# EAGLE design BBB_LEA-M8T_CAPE (EAGLE 6.6.0)
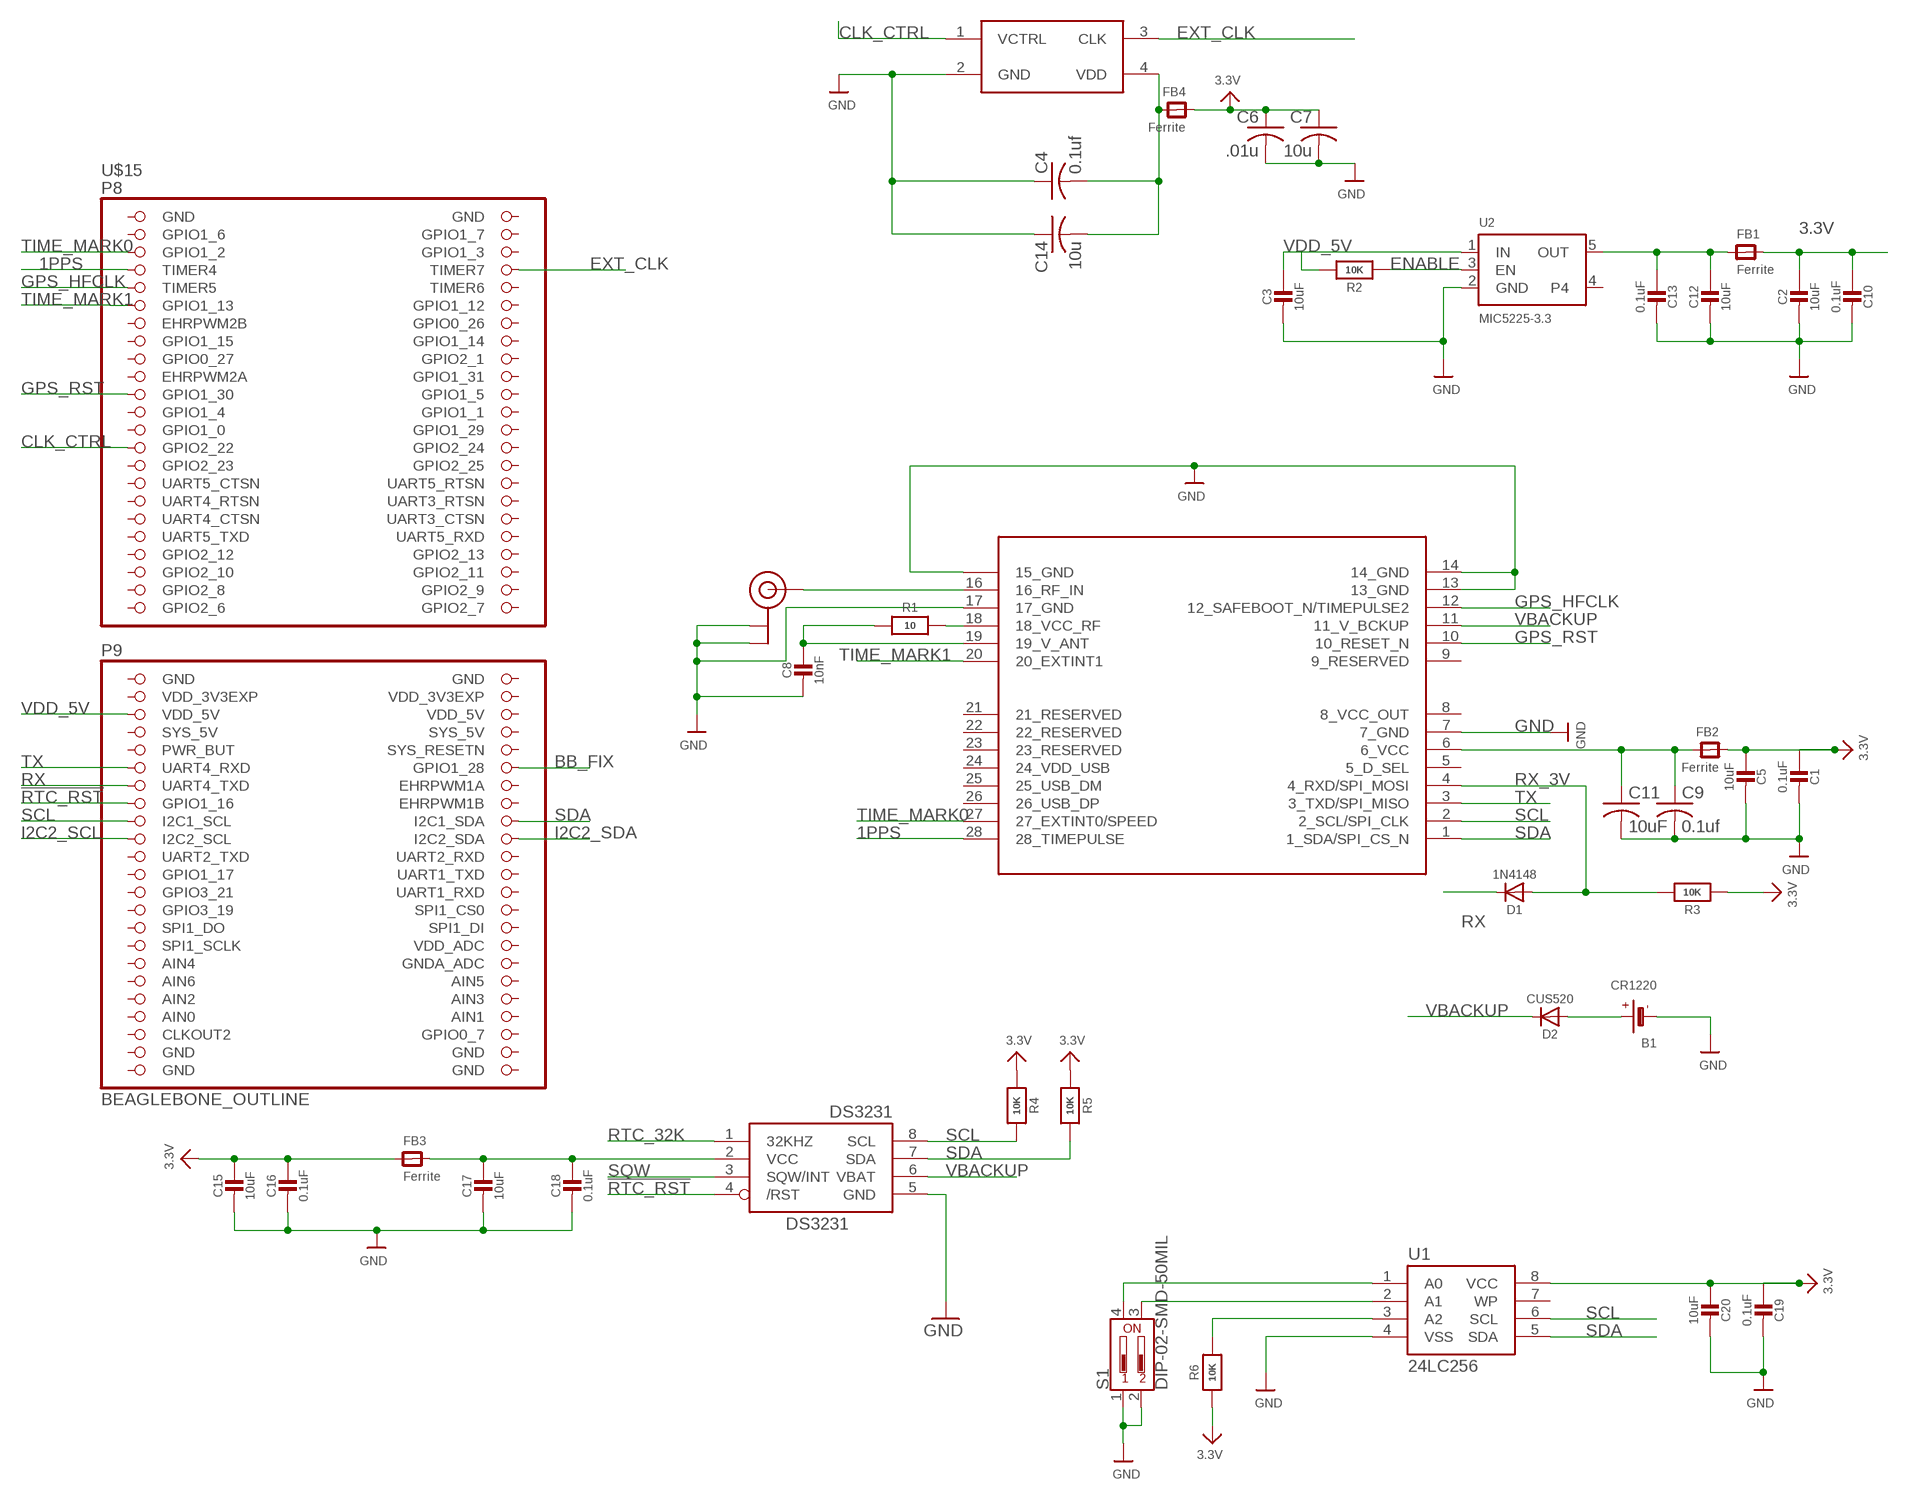
[diagram p0: schematic, sheet 1]

## Parts
B1  CR1220  BATTERYCR1220_SMT  [CR1220]
C1  0.1uF  CAP_CERAMIC0805-NOOUTLINE  [0805-NO]
C2  10uF  CAP_CERAMIC0805-NOOUTLINE  [0805-NO]
C3  10uF  CAP_CERAMIC0805-NOOUTLINE  [0805-NO]
C4  0.1uf  C-USC0805  [C0805]
C5  10uF  CAP_CERAMIC0805-NOOUTLINE  [0805-NO]
C6  .01u  C-USC0805  [C0805]
C7  10u  C-USC0805  [C0805]
C8  10nF  CAP_CERAMIC0805-NOOUTLINE  [0805-NO]
C9  0.1uf  C-USC0805  [C0805]
C10  0.1uF  CAP_CERAMIC0805-NOOUTLINE  [0805-NO]
C11  10uF  C-USC0805  [C0805]
C12  10uF  CAP_CERAMIC0805-NOOUTLINE  [0805-NO]
C13  0.1uF  CAP_CERAMIC0805-NOOUTLINE  [0805-NO]
C14  10u  C-USC0805  [C0805]
C15  10uF  CAP_CERAMIC0805-NOOUTLINE  [0805-NO]
C16  0.1uF  CAP_CERAMIC0805-NOOUTLINE  [0805-NO]
C17  10uF  CAP_CERAMIC0805-NOOUTLINE  [0805-NO]
C18  0.1uF  CAP_CERAMIC0805-NOOUTLINE  [0805-NO]
C19  0.1uF  CAP_CERAMIC0805-NOOUTLINE  [0805-NO]
C20  10uF  CAP_CERAMIC0805-NOOUTLINE  [0805-NO]
D1  1N4148  DIODESOD-323  [SOD-323]
D2  CUS520  DIODESOD-323  [SOD-323]
DS3231  DS3231M-8PIN  [SO08]
FB1  Ferrite  FERRITE-0805NO  [0805-NO@1]
FB2  Ferrite  FERRITE-0805NO  [0805-NO@1]
FB3  Ferrite  FERRITE-0805NO  [0805-NO@1]
FB4  Ferrite  FERRITE-0805NO  [0805-NO@1]
R1  10  RESISTOR0805_NOOUTLINE  [0805-NO]
R2  10K  RESISTOR0805_NOOUTLINE  [0805-NO]
R3  10K  RESISTOR0805_NOOUTLINE  [0805-NO]
R4  10K  RESISTOR0805_NOOUTLINE  [0805-NO]
R5  10K  RESISTOR0805_NOOUTLINE  [0805-NO]
R6  10K  RESISTOR0805_NOOUTLINE  [0805-NO]
S1  DIP-02-SMD-50MIL  [DIPSWITCH-02-50MIL]
U1  24LC256  EEPROM-I2CSMD  [SO08]
U2  MIC5225-3.3  VREG_SOT23-5  [SOT23-5]
U$1  LEA-M8  [LEA-M8]
U$3  TAITIEN_TW-SERIES_OSCILLATOR  [TAITIEN_TW-SERIES_OSCILLATOR]
U$15  BEAGLEBONE_OUTLINE  [BEAGLEBONE_SHIELD]
U$20  U.FL  [U.FL]

## Nets
1PPS: U$1.28(28_TIMEPULSE) U$15.7(TIMER4)
3.3V: C1.1 C2.1 C5.1 C6.1 C7.1 C10.1 C15.1 C16.1 C19.1 C20.1 FB1.2 FB2.1 FB3.1 FB4.1 R3.1 R4.1 R5.1 R6.1 U1.8(VCC)
!RTC_RST: DS3231.4(/RST) U$15.61(GPIO1_16)
BB_FIX: U$15.58(GPIO1_28)
CLK_CTRL: U$3.1(VCTRL) U$15.27(GPIO2_22)
ENABLE: R2.1 U2.3(EN)
EXT_CLK: U$3.3(CLK) U$15.8(TIMER7)
GND: B1.- C1.2 C2.2 C3.2 C4.1 C5.2 C6.2 C7.2 C8.2 C9.2 C10.2 C11.2 C12.2 C13.2 C14.1 C15.2 C16.2 C17.2 C18.2 C19.2 C20.2 DS3231.5(GND) S1.1 S1.2 U1.4(VSS) U2.2(GND) U$1.7(7_GND) U$1.13(13_GND) U$1.14(14_GND) U$1.15(15_GND) U$1.17(17_GND) U$3.2(GND) U$20.P$1(GND) U$20.P$2(GND)
GPS_HFCLK: U$1.12(12_SAFEBOOT_N/TIMEPULSE2) U$15.9(TIMER5)
GPS_RST: U$1.10(10_RESET_N) U$15.21(GPIO1_30)
I2C2_SCL: U$15.65(I2C2_SCL)
I2C2_SDA: U$15.66(I2C2_SDA)
N$1: B1.+$1(+) D2.A
N$2: C9.1 C11.1 FB2.2 U$1.6(6_VCC)
N$3: C12.1 C13.1 FB1.1 U2.5(OUT)
N$4: U$1.16(16_RF_IN) U$20.P$3(SIGNAL)
N$5: C4.2 C14.2 FB4.2 U$3.4(VDD)
N$8: C17.1 C18.1 DS3231.2(VCC) FB3.2
N$13: R6.2 U1.3(A2)
N$15: S1.3 U1.2(A1)
N$16: S1.4 U1.1(A0)
N$20: R1.2 U$1.18(18_VCC_RF)
N$21: C8.1 R1.1 U$1.19(19_V_ANT)
RTC_32K: DS3231.1(32KHZ)
RX: D1.C U$15.59(UART4_TXD)
RX_3V: D1.A R3.2 U$1.4(4_RXD/SPI_MOSI)
SCL: DS3231.8(SCL) R4.2 U1.6(SCL) U$1.2(2_SCL/SPI_CLK) U$15.63(I2C1_SCL)
SDA: DS3231.7(SDA) R5.2 U1.5(SDA) U$1.1(1_SDA/SPI_CS_N) U$15.64(I2C1_SDA)
SQW: DS3231.3(SQW/INT)
TIME_MARK0: U$1.27(27_EXTINT0/SPEED) U$15.5(GPIO1_2)
TIME_MARK1: U$1.20(20_EXTINT1) U$15.11(GPIO1_13)
TX: U$1.3(3_TXD/SPI_MISO) U$15.57(UART4_RXD)
VBACKUP: D2.C DS3231.6(VBAT) U$1.11(11_V_BCKUP)
VDD_5V: C3.1 R2.2 U2.1(IN) U$15.51(VDD_5V)
Unconnected: U1.7(WP) U2.4 U$1.5(5_D_SEL) U$1.8(8_VCC_OUT) U$1.9(9_RESERVED) U$1.21(21_RESERVED) U$1.22(22_RESERVED) U$1.23(23_RESERVED) U$1.24(24_VDD_USB) U$1.25(25_USB_DM) U$1.26(26_USB_DP) U$15.3(GPIO1_6) U$15.4(GPIO1_7) U$15.6(GPIO1_3) U$15.10(TIMER6) U$15.12(GPIO1_12) U$15.13(EHRPWM2B) U$15.14(GPIO0_26) U$15.15(GPIO1_15) U$15.16(GPIO1_14) U$15.17(GPIO0_27) U$15.18(GPIO2_1) U$15.19(EHRPWM2A) U$15.20(GPIO1_31) U$15.22(GPIO1_5) U$15.23(GPIO1_4) U$15.24(GPIO1_1) U$15.25(GPIO1_0) U$15.26(GPIO1_29) U$15.28(GPIO2_24) U$15.29(GPIO2_23) U$15.30(GPIO2_25) U$15.31(UART5_CTSN) U$15.32(UART5_RTSN) U$15.33(UART4_RTSN) U$15.34(UART3_RTSN) U$15.35(UART4_CTSN) U$15.36(UART3_CTSN) U$15.37(UART5_TXD) U$15.38(UART5_RXD) U$15.39(GPIO2_12) U$15.40(GPIO2_13) U$15.41(GPIO2_10) U$15.42(GPIO2_11) U$15.43(GPIO2_8) U$15.44(GPIO2_9) U$15.45(GPIO2_6) U$15.46(GPIO2_7) U$15.54(SYS_5V) U$15.55(PWR_BUT) U$15.56(SYS_RESETN) U$15.60(EHRPWM1A) U$15.62(EHRPWM1B) U$15.67(UART2_TXD) U$15.68(UART2_RXD) U$15.69(GPIO1_17) U$15.70(UART1_TXD) U$15.71(GPIO3_21) U$15.72(UART1_RXD) U$15.73(GPIO3_19) U$15.74(SPI1_CS0) U$15.75(SPI1_DO) U$15.76(SPI1_DI) U$15.77(SPI1_SCLK) U$15.78(VDD_ADC) U$15.79(AIN4) U$15.80(GNDA_ADC) U$15.81(AIN6) U$15.82(AIN5) U$15.83(AIN2) U$15.84(AIN3) U$15.86(AIN1) U$15.87(CLKOUT2) U$15.88(GPIO0_7)

## Power pins joined to a net without a drawn wire
AIN0: U$15.85(AIN0)
GND: U$15.1(GND) U$15.2(GND) U$15.47(GND) U$15.48(GND) U$15.89(GND) U$15.90(GND) U$15.91(GND) U$15.92(GND)
SYS_5V: U$15.53(SYS_5V)
VDD_3V3EXP: U$15.49(VDD_3V3EXP) U$15.50(VDD_3V3EXP)
VDD_5V: U$15.52(VDD_5V)

## Library data of the parts
B1 = microbuilder:BATTERY: CR1220 SMT - Digikey: 3001K-ND CD2032 BAT-HLD-001 - Digikey: BAT-HLD-001-ND
C1-C3 C5 C8 C10 C12 C13 C15-C20 = microbuilder:CAP_CERAMIC: Ceramic Capacitors For new designs, use the packages preceded by an '_' character since they are more reliable: The following footprints should be used on most boards: _0402 - Standard footprint for regular board layouts _0603 - Standard footprint for regular board layouts _0805 - Standard footprint for regular board layouts _1206 - Standard footprint for regular board layouts For extremely tight-pitch boards where space is at a premium, the following 'micro-pitch' footprints can be used (smaller pads, no silkscreen outline, etc.): _0402MP - Micro-pitch footprint for very dense/compact boards _0603MP - Micro-pitch footprint for very dense/compact boards _0805MP - Micro-pitch footprint for very dense/compact boards _1206MP - Micro-pitch footprint for very dense/compact boards
C4 C6 C7 C9 C11 C14 = rcl:C-US: CAPACITOR, American symbol
D1 D2 = microbuilder:DIODE: Diode SMA Model Volts Amps Type Vf Ir Digikey # Notes SSA34-E3 40V 3A Schottky 480mV @ 3A 200uA @ 40V SSA34-E3/61TGITR-ND CDBA120-G 20V 1A Schottky 500mV @ 1A 500uA @ 20V 641-1014-6-ND REEL MBRA210 10V 2A Schottky 350mV @ 2A 700uA @ 10V MBRA210LT3 SOD-123 Model Volts Amps Type Vf Ir Order # Notes BAT54T1G 30V 200mA Schottky 800mV @ 200mA 2uA @ 25V BAT54T1GOSTR-ND B0530W 30V 500mA Schottky 430mV @ 500mA 130uA @ 30V B0530W-FDICT-ND REEL MBR120 20V 1A Schottky 340mV @ 1A MBR120VLSFT1GOSCT-ND SOD-323 Model Volts Amps Type Vf Ir Order # Notes PMEG2005EJ 20V 500mA Schottky 355mV @ 500mA 568-4110-1-ND ZLLS410 10V 570mA Schottky 380mV @ 570mA ZLLS410CT-ND 1N4148WS 75V 150mA Silicon/Simple 1V 1N4148WSFSCT-ND REEL SOD-523 Model Volts Amps Type Vf Ir Order # Notes BAT54XV2 30V 200mA Schottky 0.8V @ 100mA BAT54XV2CT-ND TB751S 30V 30mA Schottky RB751S-40TE61CT-ND SOT23-R/W (R = Solder Paste/Reflow Ovens, W = Hand-Soldering) Model Volts Amps Type Vf Ir Order # Notes BAT54FILM 40V 300mA Schottky 497-7162-1-ND POWERDI-5 Model Volts Amps Type Vf Ir Order # Notes PDS560 60V 5A Schottky 670mV @ 5A 150uA @ 60V PDS560DICT-ND
DS3231 = tuckerLib:DS3231M-8PIN
FB1-FB4 = microbuilder:FERRITE: Ferrite Bead 0603 MMZ1608B121C - 120 Ohm @ 100MHz, 600mA, 0.15 Ohm DC Resistance - Digikey: 445-2164-1-ND BK1608HW121-T - 120 Ohm, 600mA Ferrite Chip - Digikey: 587-1876-2-ND 0805 HZ0805B272R-10 - 2.7K Ohm @ 100MHz, 200mA, 0.8 Ohm DC Resistance - Digikey: 240-2504-1-ND (see also Murata BLM21BD272SN1L) MMZ2012Y152B - 1.5K Ohm @ 100MHz, 500mA, 0.4 Ohm DC Resistance - Digikey: 445-1560-1-ND - Mainly for high frequency (80-400MHz) MMZ2012R102A - 1K Ohm @ 100MHz, 500mA, 0.3 Ohm DC Resistance - Digikey: 445-1555-2-ND - More general purpose (10-200MHz)
R1-R6 = microbuilder:RESISTOR: Resistors For new designs, use the packages preceded by an '_' character since they are more reliable: The following footprints should be used on most boards: _0402 - Standard footprint for regular board layouts _0603 - Standard footprint for regular board layouts _0805 - Standard footprint for regular board layouts _1206 - Standard footprint for regular board layouts For extremely tight-pitch boards where space is at a premium, the following 'micro-pitch' footprints can be used (smaller pads, no silkscreen outline, etc.): _0402MP - Micro-pitch footprint for very dense/compact boards _0603MP - Micro-pitch footprint for very dense/compact boards _0805MP - Micro-pitch footprint for very dense/compact boards _1206MP - Micro-pitch footprint for very dense/compact boards
S1 = SparkFun-Switches:DIP-02: 2-Position DIP Switch 2-circuit DIP (dual inline package) switch. Commonly used to physcially set a circuit's behavior. Variants PTH-100MIL - Through-hole, 0.1"-Pitch Used on SparkFun Stepoko <https://www.sparkfun.com/products/13899> (ROB-13899) SMD-50MIL-JWING - SMD (J-Wing Pads), 0.05"-Pitch Prototype Part SMD-50MIL - SMD, 0.05"-Pitch Used on SparkFun Battery Babysitter <https://www.sparkfun.com/products/13777> (PRT-13777); PROD_ID: SWCH-13215
U1 = SparkFun-IC-Memory:EEPROM-I2C: I2C EEPROMs, 24LC256 and others 24LC256 Series 256 kb I2C 2 Wire (32 k x 8 Bit) 2.5 V Serial EEPROM SMD - SOIC-8 Datasheet SparkFun Products SparkFun UDB5 - PIC UAV Development Board <https://www.sparkfun.com/products/11703> (GPS-11703); PROD_ID: IC-09714
U2 = microbuilder:VREG_SOT23-5: SOT23-5 Fixed Voltage Regulators Part Current Out V Out V In V Dropout θJA (°C/W) TJ (°C) Digikey Part No. ADP121 150mA 3.3V 3.4-5.5V 0.09V @ 150mA -- -- ADP121-AUJZ33R7CT-ND ADP121 150mA 3.0V 3.1-5.5V 0.09V @ 150mA -- -- ADP121-AUJZ30R7CT-ND ADP122 300mA 3.3V 3.4-5.5V 0.085V @ 300mA -- -- ADP122AUJZ-3.3-R7CT-ND ADP1712 300mA 3.3V 3.5-5.5V 0.17V @ 300mA -- -- ADP1712AUJZ-3.3-R7TR-ND AP7311 (Low Cost) 150mA 3.3V 3.5-6V 0.15V @ 150mA -- -- AP7311-33WG-7DICT-ND LD39015M18R 150mA 1.8V 1.9V-5.5V 0.08V @ 100mA -- -- 497-6977-1-ND LP2985A-33DBVR 150mA 3.3V 3.3-16V 0.28V @ 150mA 206 150 296-18479-1-ND MCP1824T-3302E/OT 300mA 3.3V 3.5V-6V 0.2V @ 300mA -- -- MCP1824T-3302E/OTCT-ND MIC5205-2.5YM5 TR 150mA 2.5V 2.7-16V 0.165V @ 150mA -- -- 576-1257-2-ND MIC5205-3.0YM5 TR 150mA 3.0V 3.2V-16V 0.165V @ 150mA -- -- 576-1258-2-ND MIC5205-3.3YM5 TR 150mA 3.3V 3.5V-16V 0.165V @ 150mA -- -- 576-1259-2-ND TPS780330220 150mA 3.3V+2.2V 3.6-5.5V 250mV Max -- -- 296-23332-1-ND TDA3663/N1,135 100mA 3.3V 3.5-45V 0.18V @ 50mA -- -- 568-5343-1-ND Max operating temp can be calculated using θJA, TJ (max junction temperature), and power in watts. Set the "Maximum Ambient Temperature" until it reaches TJ ("Max Junction Temperature"), which is the absolute limit for safe use of the regulator: Heat Sink Temperature Calculator <http://www.daycounter.com/Calculators/Heat-Sink-Temperature-Calculator.phtml> For example, With 12V source into a 3.3V LP2985 and a 30mA load, we are dissipating (12V-3.3V) * 0.03A = 0.261W. With a θJA of 206 °C/W, a TJ of 150°C, and 261mW we can safely use the chip without a heat sink up to 75°C (=147.1°C Junction Temperature).
U$1 = ubloxLib:LEA-M8: u-blox LEA GNSS module
U$3 = tuckerLib:TAITIEN_TW-SERIES_OSCILLATOR
U$15 = adafruit:BEAGLEBONE_OUTLINE: Should match A3 pinout - but not completely tested
U$20 = microbuilder:U.FL: U.FL Antenna Connector

## Board
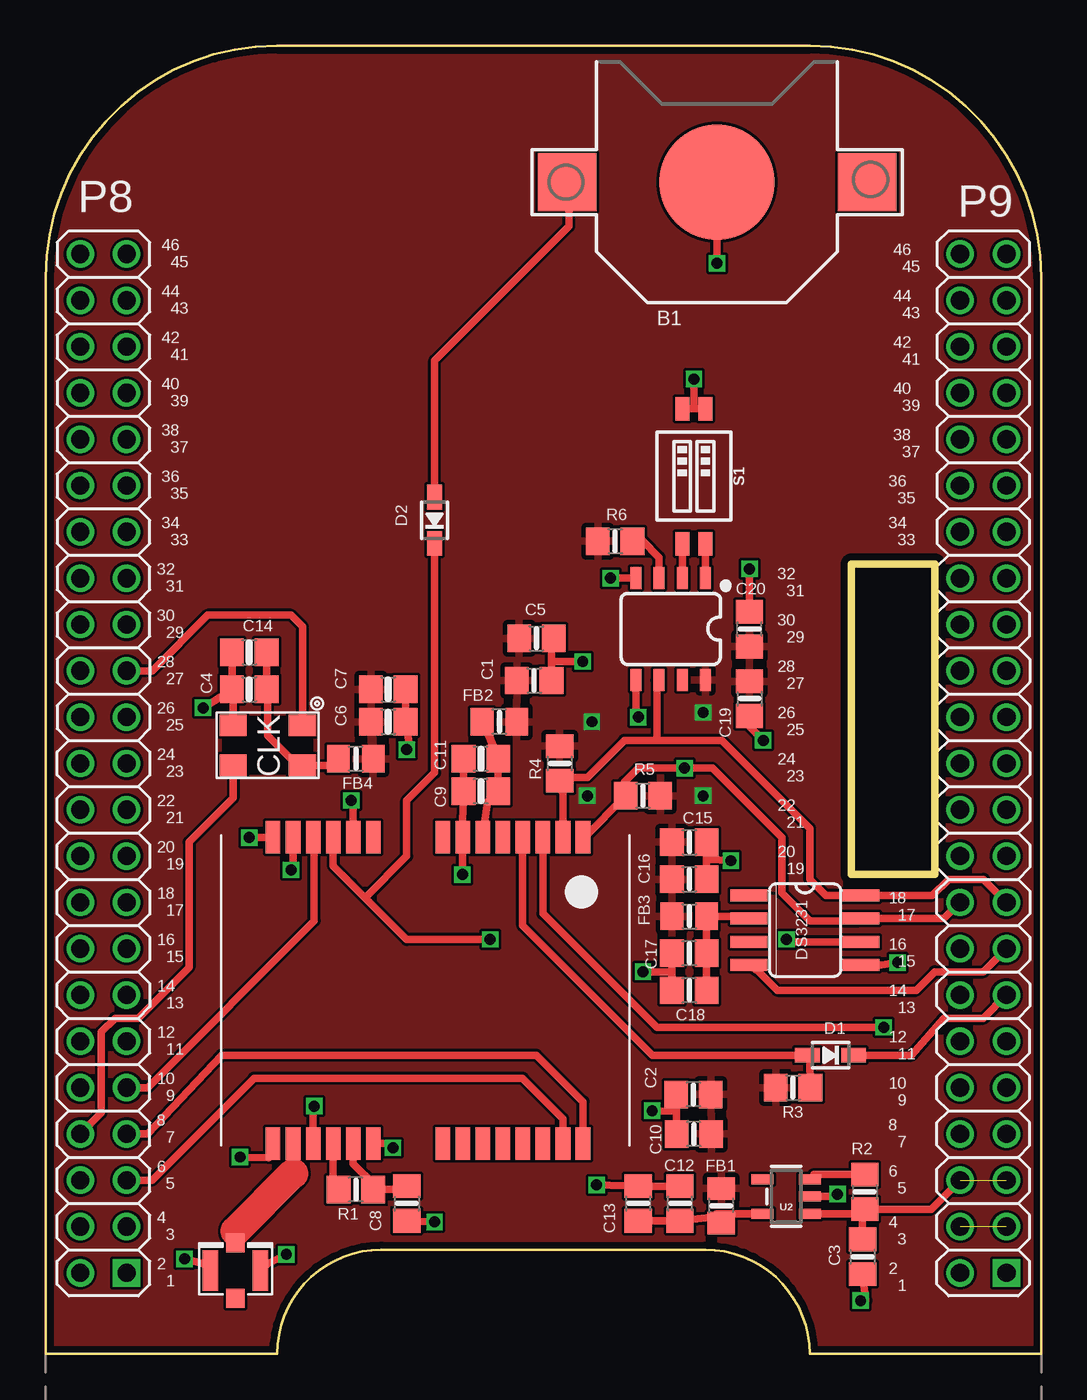
[diagram p1: board, top side]
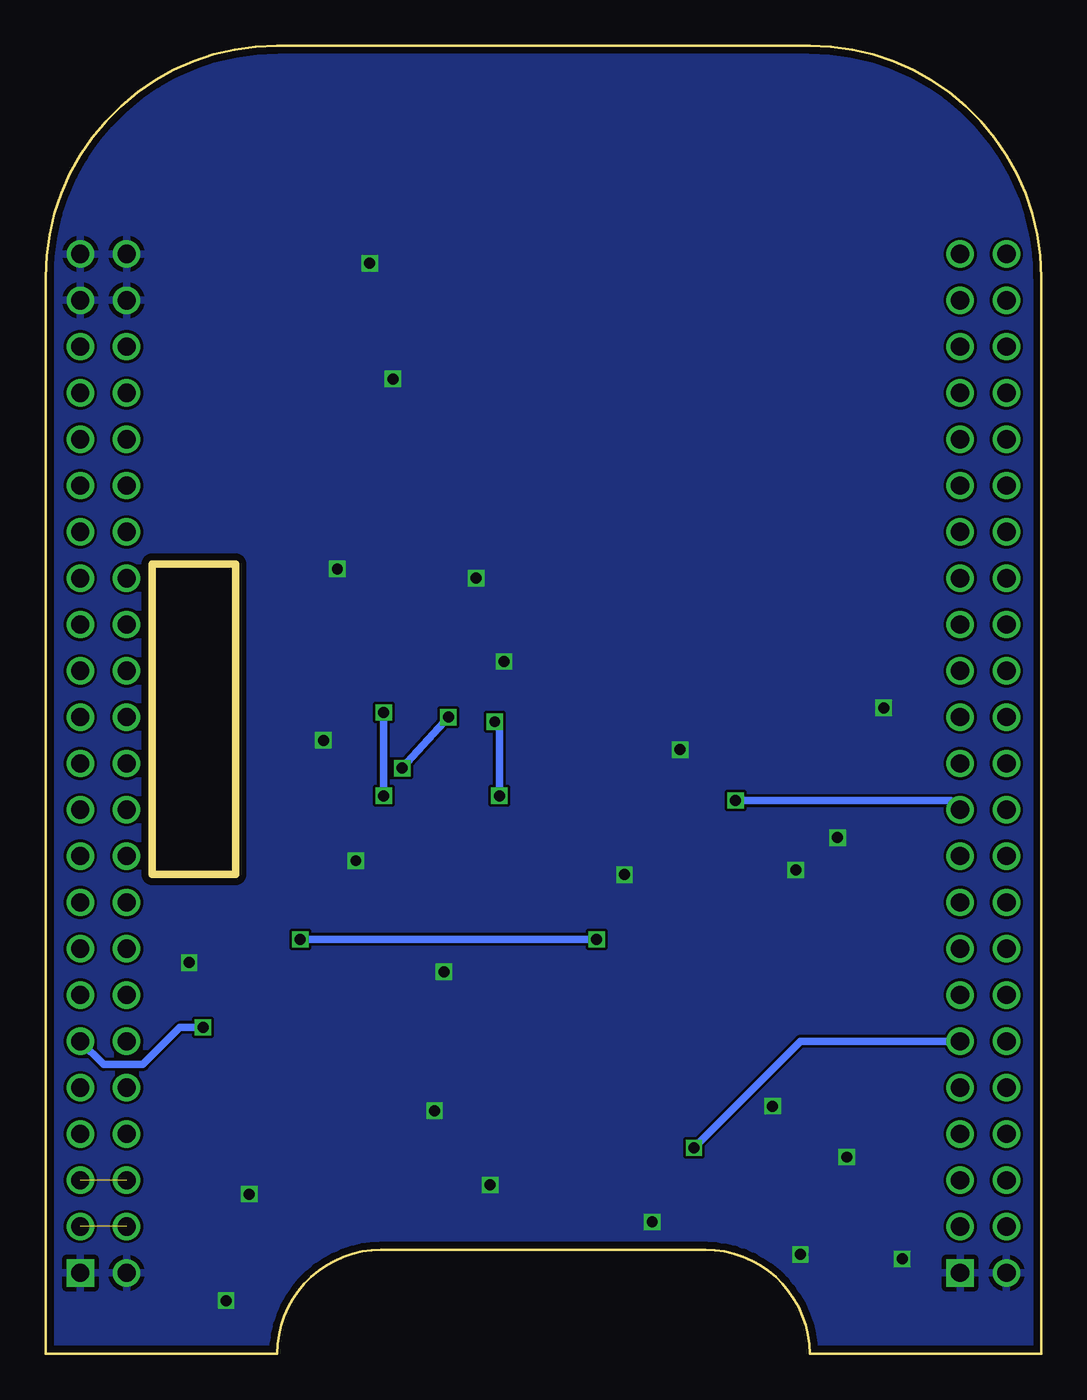
[diagram p2: board, bottom side, seen from below]

Size 54.61 x 71.76 mm. Coordinates in mm from the lower left corner, seen from the top.
Copper layers (1*16): Top 0.035559375mm / dielectric 1.6mm / Bottom 0.035559375mm
Design rules "oshpark-2layer": minimum track width 6mil, minimum drill 10mil, track to track 6mil, track to pad 6mil, pad to pad 6mil, via to via 6mil, smd to smd 6mil, copper to edge 15mil, drill to drill 6mil, minimum pad ring 5mil, minimum via ring 5mil, stop-mask expansion 2.5mil, vias tented up to drill 0mil, thermal gap 10mil
bRestrict: area 14.7,3 to 15.2,3.2; area 13.7,1.7 to 13.8,2.2; area 16.1,1.7 to 16.3,2.2

### Footprints (pad centres in the part's own frame; a part is rotated, then mirrored left to right if it is on the bottom)
CR1220 = smd 3.2 x 3.2: +$1 -8.225,0; +$2 8.225,0 | smd 6.35 x 6.35: - 0,0
0805-NO = smd 1.3 x 1.5: 1 -0.95,0; 2 0.95,0
C0805 = smd 1.3 x 1.5: 1 -0.95,0; 2 0.95,0
SOD-323 = smd 1.35 x 0.8: A 1.27,0; C -1.27,0
SO08 = smd 0.66 x 2.032: 1 -1.905,-3.073; 2 -0.635,-3.073; 3 0.635,-3.073; 4 1.905,-3.073; 5 1.905,3.073; 6 0.635,3.073; 7 -0.635,3.073; 8 -1.905,3.073
0805-NO@1 = smd 1.24 x 1.5: 1 -0.95,0; 2 0.95,0
DIPSWITCH-02-50MIL = smd 0.762 x 1.27: 1 -0.635,-3.7; 2 0.635,-3.7; 3 0.635,3.7; 4 -0.635,3.7
SO08' = smd 0.6 x 1.2: 1 -1.905,-2.8; 2 -0.635,-2.8; 3 0.635,-2.8; 4 1.905,-2.8; 5 1.905,2.8; 6 0.635,2.8; 7 -0.635,2.8; 8 -1.905,2.8
SOT23-5 = smd 0.55 x 1.2: 1 -0.95,-1.3; 2 0,-1.3; 3 0.95,-1.3; 4 0.95,1.3; 5 -0.95,1.3
LEA-M8 = smd 1.8 x 0.8: 1 8.4,-8.65; 2 8.4,-7.55; 3 8.4,-6.45; 4 8.4,-5.35; 5 8.4,-4.25; 6 8.4,-3.15; 7 8.4,-2.05; 8 8.4,-0.95; 9 8.4,2.85; 10 8.4,3.95; 11 8.4,5.05; 12 8.4,6.15; 13 8.4,7.25; 14 8.4,8.35; 15 -8.4,8.35; 16 -8.4,7.25; 17 -8.4,6.15; 18 -8.4,5.05; 19 -8.4,3.95; 20 -8.4,2.85; 21 -8.4,-0.95; 22 -8.4,-2.05; 23 -8.4,-3.15; 24 -8.4,-4.25; 25 -8.4,-5.35; 26 -8.4,-6.45; 27 -8.4,-7.55; 28 -8.4,-8.65
TAITIEN_TW-SERIES_OSCILLATOR = smd 1.5 x 1.2: 1 0.9,0.7; 2 4.7,0.7; 3 4.7,2.9; 4 0.9,2.9
BEAGLEBONE_SHIELD = drill 1 square: 1 4.445,19.05; 47 52.705,19.05 | drill 1: 2 1.905,19.05; 3 4.445,21.59; 4 1.905,21.59; 5 4.445,24.13; 6 1.905,24.13; 7 4.445,26.67; 8 1.905,26.67; 9 4.445,29.21; 10 1.905,29.21; 11 4.445,31.75; 12 1.905,31.75; 13 4.445,34.29; 14 1.905,34.29; 15 4.445,36.83; 16 1.905,36.83; 17 4.445,39.37; 18 1.905,39.37; 19 4.445,41.91; 20 1.905,41.91; 21 4.445,44.45; 22 1.905,44.45; 23 4.445,46.99; 24 1.905,46.99; 25 4.445,49.53; 26 1.905,49.53; 27 4.445,52.07; 28 1.905,52.07; 29 4.445,54.61; 30 1.905,54.61; 31 4.445,57.15; 32 1.905,57.15; 33 4.445,59.69; 34 1.905,59.69; 35 4.445,62.23; 36 1.905,62.23; 37 4.445,64.77; 38 1.905,64.77; 39 4.445,67.31; 40 1.905,67.31; 41 4.445,69.85; 42 1.905,69.85; 43 4.445,72.39; 44 1.905,72.39; 45 4.445,74.93; 46 1.905,74.93; 48 50.165,19.05; 49 52.705,21.59; 50 50.165,21.59; 51 52.705,24.13; 52 50.165,24.13; 53 52.705,26.67; 54 50.165,26.67; 55 52.705,29.21; 56 50.165,29.21; 57 52.705,31.75; 58 50.165,31.75; 59 52.705,34.29; 60 50.165,34.29; 61 52.705,36.83; 62 50.165,36.83; 63 52.705,39.37; 64 50.165,39.37; 65 52.705,41.91; 66 50.165,41.91; 67 52.705,44.45; 68 50.165,44.45; 69 52.705,46.99; 70 50.165,46.99; 71 52.705,49.53; 72 50.165,49.53; 73 52.705,52.07; 74 50.165,52.07; 75 52.705,54.61; 76 50.165,54.61; 77 52.705,57.15; 78 50.165,57.15; 79 52.705,59.69; 80 50.165,59.69; 81 52.705,62.23; 82 50.165,62.23; 83 52.705,64.77; 84 50.165,64.77; 85 52.705,67.31; 86 50.165,67.31; 87 52.705,69.85; 88 50.165,69.85; 89 52.705,72.39; 90 50.165,72.39; 91 52.705,74.93; 92 50.165,74.93
U.FL = smd 2.2 x 0.85: P$1 0,1.375; P$2 0,-1.375 | smd 1.05 x 1: P$3 1.525,0; P$4 -1.525,0

### Placement (x,y rotation side)
B1  36.83,64.26 0 top
C1  26.8,36.93 0 top
C2  35.54,14.22 180 top
C3  44.81,5.33 270 top
C4  11.18,36.45 0 top
C5  26.92,39.24 0 top
C6  18.8,34.67 0 top
C7  18.8,36.45 0 top
C8  19.81,8.25 270 top
C9  23.88,30.86 180 top
C10  35.56,12.06 180 top
C11  23.88,32.64 180 top
C12  34.8,8.25 90 top
C13  32.51,8.25 90 top
C14  11.18,38.48 0 top
C15  35.31,28.07 0 top
C16  35.31,26.03 0 top
C17  35.31,21.97 180 top
C18  35.31,19.94 180 top
C19  38.61,35.94 270 top
C20  38.61,39.75 90 top
D1  43.05,16.38 180 top
D2  21.34,45.72 90 top
DS3231  41.66,23.24 270 top
FB1  37.06,8.13 90 top
FB2  24.89,34.67 180 top
FB3  35.31,24 0 top
FB4  17.02,32.64 180 top
R1  17.02,9.02 180 top
R2  44.93,8.89 270 top
R3  41,14.6 0 top
R4  28.19,32.38 270 top
R5  32.77,30.61 180 top
R6  31.24,44.58 0 top
S1  35.56,48.13 180 top
U1  24LC256  [SO08']  34.29,39.75 180 top
U2  40.62,8.64 90 top
U$1  20.83,19.94 90 top
U$3  14.99,35.18 180 top
U$15  0,-14.61 0 top
U$20  10.41,4.57 90 top

### Tracks (layer width: path | path; a pad name or v marks a point on that pad's centre or on a via)
1PPS
  Top 0.406: U$1.28 29.48,13.83 26.92,16.38 9.65,16.38 5.59,12.06 U$15.7
3.3V  (via drill 0.6)
  Bottom 0.406: v36.07,30.61 v36.07,35.18 | v29.72,30.61 29.72,34.42 v29.97,34.67
  pour Top: 0,0.13 0,59.31 arc-90 12.19,71.5 42.93,71.5 arc-90 54.36,60.07 54.36,0.13 41.66,0.13 arc90 36.07,5.71 18.54,5.71 18.29,5.71 arc90 12.7,0.13
!RTC_RST
  Top 0.406: DS3231.4 39.09,20.98 40.13,19.94 47.75,19.94 48.77,20.95 51.44,20.95 U$15.61
CLK_CTRL
  Top 0.406: U$3.1 14.09,39.89 13.46,40.51 8.89,40.51 5.84,37.46 U$15.27
ENABLE
  Top 0.406: U2.3 42.14,9.84 R2.1
EXT_CLK
  Top 0.406: U$3.3 10.29,30.48 7.87,28.07 7.87,21.21 5.08,18.41 3.81,18.41 3.05,17.65 3.05,13.21 U$15.8
GND  (via drill 0.6)
  Top 0.406: C8.2 19.62,7.3 v21.34,7.24 | U$1.13 13.58,26.91 v13.46,26.54 | U$3.2 10.29,36.39 C4.1 | C4.1 C14.1 | C4.1 v8.64,35.43 | C7.2 C6.2 20,33.21 v19.81,33.15 | v22.86,26.29 22.86,28.32 U$1.7 22.86,28.36 22.86,29.34 22.93,30.29 C9.2 C11.2 | C1.2 27.75,37.97 | 27.75,37.97 27.75,39.12 C5.2 | v29.46,37.97 27.75,37.97 | v13.21,5.46 12.17,4.95 U$20.P$2 | U$20.P$1 8.66,4.95 v7.62,5.21 | v44.7,2.92 45,2.92 C3.2 | v30.23,9.27 C13.2 C12.2 | C10.2 34.61,14.2 C2.2 34.59,13.29 v33.27,13.33 | DS3231.5 45.85,21.34 v46.74,21.46 | v37.59,27.05 36.32,27.12 C15.2 C16.2 | C18.2 34.36,20.95 | 34.36,20.95 C17.2 | v32.77,20.95 34.36,20.95 | v36.83,59.82 B1.- | U2.2 43.31,8.64 v43.43,8.76 | U$1.15 12.22,10.76 v10.67,10.79 | U$1.17 14.68,13.54 v14.73,13.59 | U$1.14 12.17,28.34 v11.18,28.32 | C19.2 38.61,34.42 v39.37,33.65 | C20.2 v38.61,43.05 | v30.99,42.54 U1.4 | S1.2 35.56,51.83 | 35.56,51.83 S1.1 | v35.56,53.47 35.56,51.83
  pour Bottom: 0,0.13 0,59.05 0,59.56 arc-90 12.19,71.76 42.42,71.76 arc-90 54.61,59.56 54.61,-0.13 41.66,-0.13 arc90 35.81,5.71 20.07,5.71 18.29,5.71 arc90 12.7,0.13
GPS_HFCLK
  Top 0.406: U$15.9 5.59,14.6 14.73,23.75 14.73,28.28 U$1.12
GPS_RST  (via drill 0.6)
  Top 0.406: U$1.10 16.88,30.24 v16.76,30.35
  Bottom 0.406: v16.76,30.35 4.95,30.35 U$15.21
N$1
  Top 0.406: D2.A 21.34,54.48 28.7,61.85 28.7,64.17 B1.+$1
N$2
  Top 0.406: U$1.6 24.23,30.27 C9.1 C11.1 24.06,34.55 FB2.2
N$3
  Top 0.406: U2.5 36.81,7.69 FB1.1 36.93,7.56 C12.1 C13.1
N$4
  Top 0.406: U$20.P$3 10.41,6.73
  Top 0.762: U$1.16 13.58,9.89
  Top 1.651: 13.58,9.89 10.41,6.73
N$5
  Top 0.406: C14.2 C4.2 12.19,36.38 12.19,33.91 13.82,32.28 U$3.4 15.96,32.28 FB4.2
N$8
  Top 0.406: C18.1 C17.1 FB3.2 38.46,24 DS3231.2
N$13
  Top 0.406: U1.3 33.66,43.69 32.77,44.58 R6.2
N$15
  Top 0.406: S1.3 U1.2
N$16
  Top 0.406: S1.4 U1.1
N$20
  Top 0.406: U$1.18 15.78,9.49 R1.2
N$21
  Top 0.406: U$1.19 16.88,10.43 18.03,9.27 18.03,9.21 R1.1 19.75,9.02 C8.1
RX
  Top 0.406: D1.C 47.5,16.38 49.28,18.41 51.44,18.41 U$15.59
RX_3V
  Top 0.406: R3.2 41.91,16.26 D1.A 33.27,16.38 26.16,23.49 26.16,28.32 U$1.4
SCL
  Top 0.406: U$15.63 51.44,26.03 49.53,26.03 48.64,25.15 DS3231.8 42.8,25.15 41.91,26.03 41.91,28.83 37.08,33.65 33.53,33.65 | U$1.2 28.38,30.74 R4.2 29.02,31.62 29.72,31.62 31.75,33.65 33.53,33.65 | U1.6 33.53,36.95 33.53,33.65
SDA  (via drill 0.6)
  Top 0.406: U$15.64 49.28,23.88 DS3231.7 44.6,23.75 41.91,23.75 40.39,25.27 40.39,28.32 36.58,32.13 v35.05,32.13 32.51,32.13 31.75,31.37 31.75,30.67 R5.2 29.55,28.34 U$1.1 | v32.51,34.92 32.39,35.05 U1.5
  Bottom 0.406: v35.05,32.13 32.77,34.67 v32.51,34.92
TIME_MARK0
  Top 0.406: U$1.27 28.38,12.9 26.16,15.11 11.43,15.11 5.84,9.52 U$15.5
TIME_MARK1  (via drill 0.6)
  Top 0.406: U$1.20 19.07,11.54 v19.05,11.3
  Bottom 0.406: U$15.11 13.21,17.14 v19.05,11.3
TX  (via drill 0.6)
  Top 0.406: U$1.3 27.28,24.16 33.53,17.91 v45.97,17.91
  Bottom 0.406: v45.97,17.91 47.24,17.91 49.28,15.87 51.44,15.87 U$15.57
VBACKUP  (via drill 0.6)
  Top 0.406: U$1.11 15.78,26.77 16.76,25.78 17.53,25.02 | 17.53,25.02 19.81,27.3 19.81,30.35 21.34,31.88 D2.C | DS3231.6 41.02,22.61 v40.64,22.73 | v24.38,22.73 19.81,22.73 17.53,25.02
  Bottom 0.406: v24.38,22.73 v40.64,22.73
VDD_3V3EXP  (1 unrouted)
VDD_5V  (1 unrouted)
  Top 0.406: C3.1 44.81,8.07 R2.2 | U2.1 44.68,7.69 R2.2 | R2.2 48.58,7.94 U$15.52

### Text on the board
tNames: P8 | P9 | 46 / 45 | 46 / 45 | 44 / 43 | 44 / 43 | 42 / 41 | 42 / 41 | 40 / 39 | 40 / 39 | 38 / 37 | 38 / 37 | 36 / 35 | 36 / 35 | 34 / 33 | 34 / 33 | 32 / 31 | 32 / 31 | 30 / 29 | 30 / 29 | 28 / 27 | 28 / 27 | 26 / 25 | 26 / 25 | 24 / 23 | 24 / 23 | 22 / 21 | 22 / 21 | 20 / 19 | 20 / 19 | 18 / 17 | 18 / 17 | 16 / 15 | 16 / 15 | 14 / 13 | 14 / 13 | 12 / 11 | 12 / 11 | 10 / 9 | 10 / 9 | 8 / 7 | 8 / 7 | 6 / 5 | 6 / 5 | 4 / 3 | 4 / 3 | 2 / 1 | 2 / 1